# Altium schematic sheet MOD.SchDoc: Modification Information
size B; DrawnBy: DJW; DocumentNumber: 17; SheetNumber: 17; SheetTotal: 17
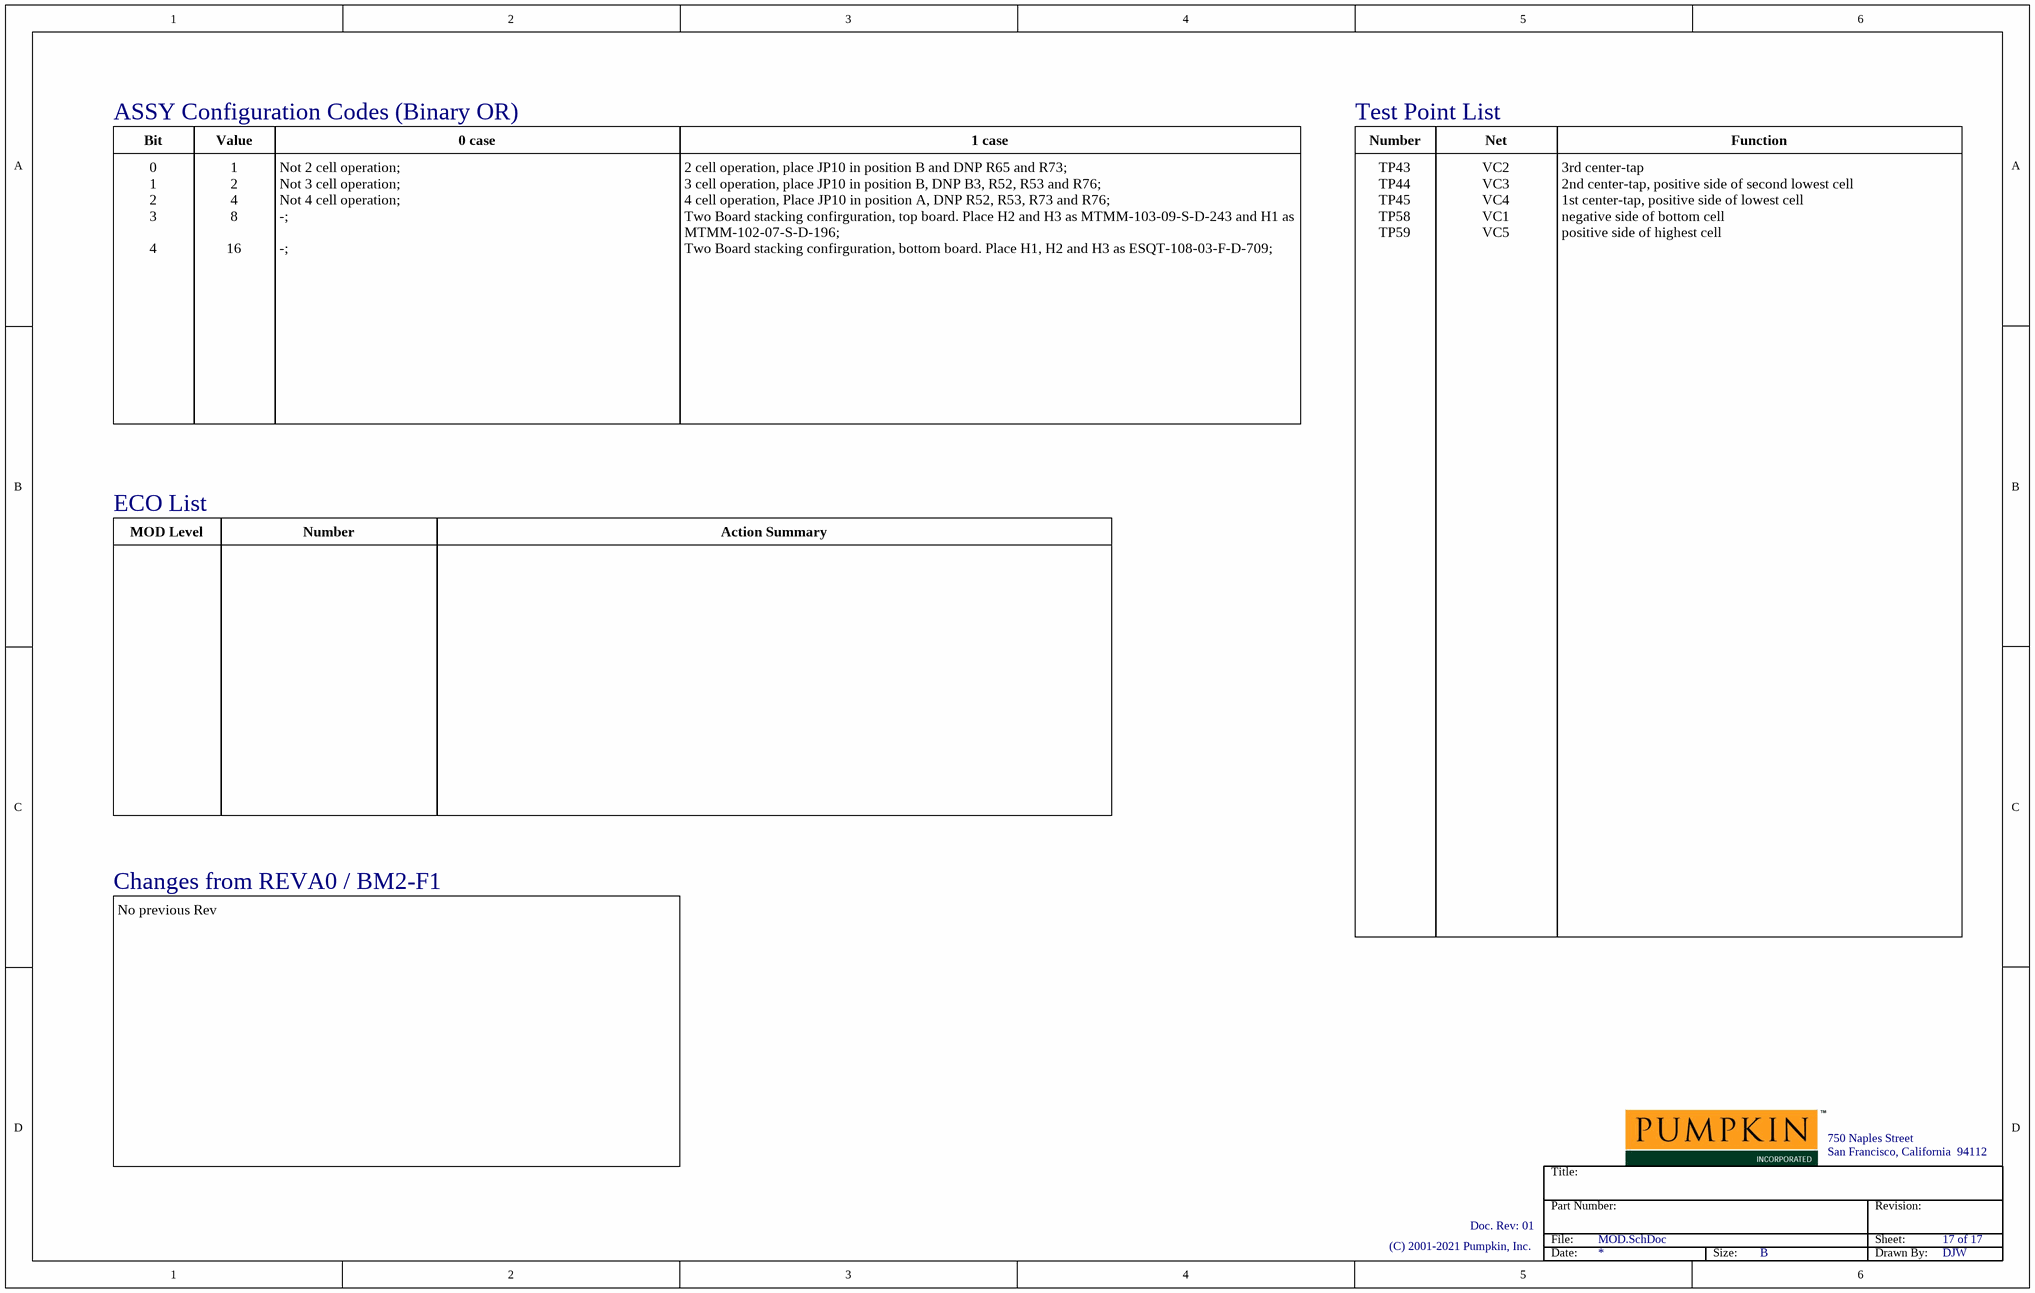
[diagram p0: MOD.SchDoc]

## Notes on the sheet
- ASSY Configuration Codes (Binary OR)
- Bit
- Value
- 0 case
- 1 case
- Test Point List
- Number
- Net
- Function
- 0
  1
  2
  3
  4
- 1
  2
  4
  8
  16
- Not 2 cell operation;
  Not 3 cell operation;
  Not 4 cell operation;
  -;
  -;
- 2 cell operation, place JP10 in position B and DNP R65 and R73;
  3 cell operation, place JP10 in position B, DNP B3, R52, R53 and R76;
  4 cell operation, Place JP10 in position A, DNP R52, R53, R73 and R76;
  Two Board stacking confirguration, top board. Place H2 and H3 as MTMM-103-09-S-D-243 and H1 as MTMM-102-07-S-D-196;
  Two Board stacking confirguration, bottom board. Place H1, H2 and H3 as ESQT-108-03-F-D-709;
- ECO List
- MOD Level
- Action Summary
- Changes from REVA0 / BM2-F1
- TP43
  TP44
  TP45
  TP58
  TP59
- VC2
  VC3
  VC4
  VC1
  VC5
- 3rd center-tap
  2nd center-tap, positive side of second lowest cell
  1st center-tap, positive side of lowest cell
  negative side of bottom cell
  positive side of highest cell
- No previous Rev
- Title:
- 750 Naples Street
- San Francisco, California  94112
- Doc. Rev: 01
- File:
- Part Number:
- Revision:
- Sheet:
- (C) 2001-2021 Pumpkin, Inc.
- Date:
- Size:
- B
- Drawn By: